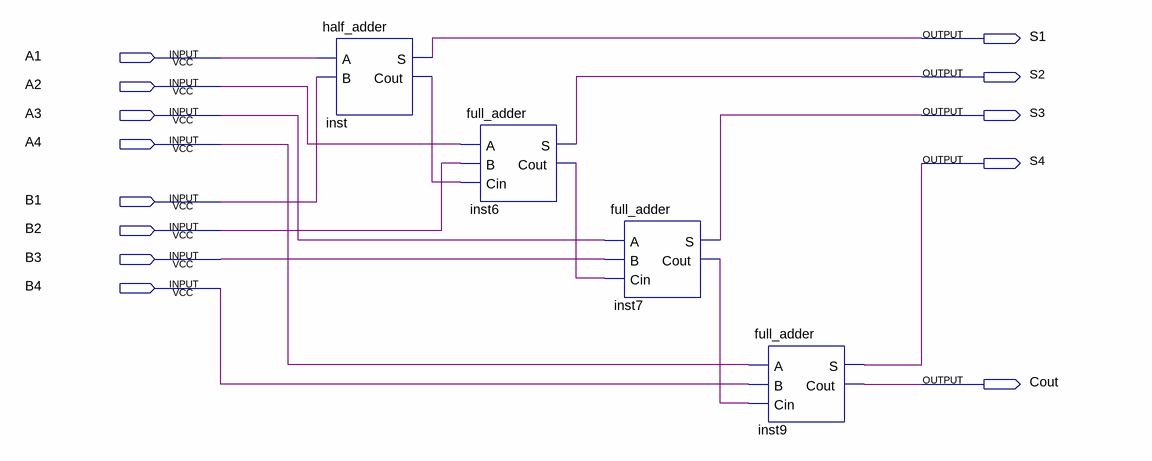
[diagram p0: schematic sheet]
// Quartus schematic adder_4bit.bdf as structural Verilog: 4 symbols, 13 pins
module adder_4bit (
  input  A1,
  input  A2,
  input  A3,
  input  A4,
  input  B1,
  input  B2,
  input  B3,
  input  B4,
  output S1,
  output S2,
  output S3,
  output S4,
  output Cout
);

  wire inst6_cout, inst7_cout, inst_cout;

  half_adder inst (.A(A1), .B(B1), .S(S1), .Cout(inst_cout));
  full_adder inst6 (.A(A2), .B(B2), .Cin(inst_cout), .S(S2), .Cout(inst6_cout));
  full_adder inst7 (.A(A3), .B(B3), .Cin(inst6_cout), .S(S3), .Cout(inst7_cout));
  full_adder inst9 (.A(A4), .B(B4), .Cin(inst7_cout), .S(S4), .Cout(Cout));
endmodule
